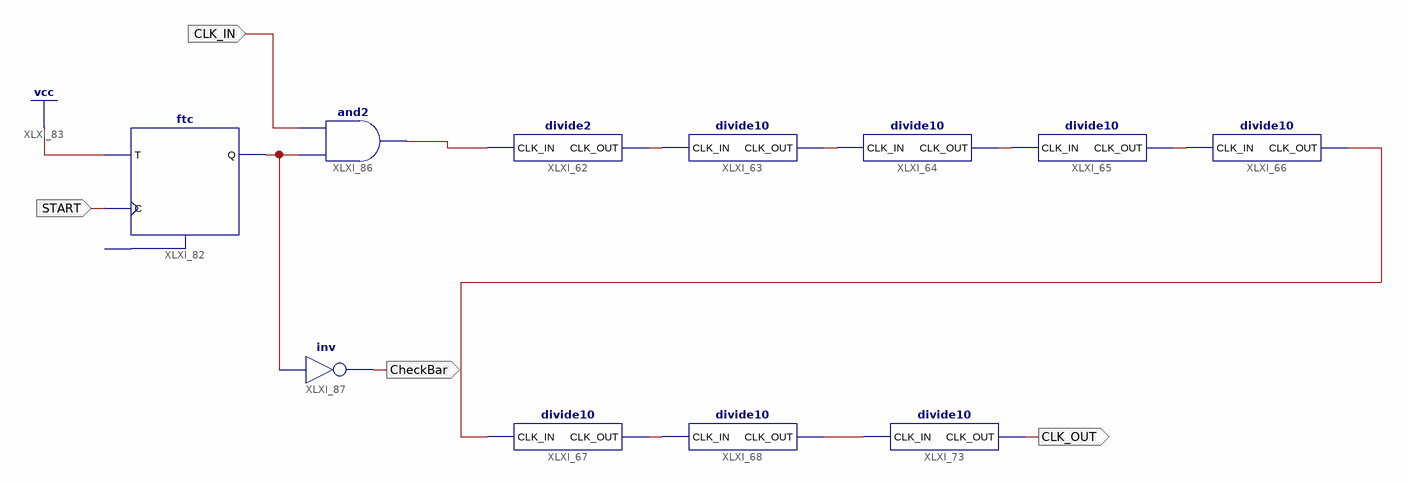
[diagram p0: schematic sheet 1]
// Xilinx ISE schematic Divider2.sch (spartan6) as structural Verilog: 11 symbols, 4 ports
module Divider2 (
  input  START,
  input  CLK_IN,
  output CLK_OUT,
  output CheckBar
);

  wire CLK_10K, XLXN_124, XLXN_125, XLXN_126, XLXN_127, XLXN_128, XLXN_138, XLXN_156, XLXN_157;

  divide2 XLXI_62 (.CLK_IN(XLXN_157), .CLK_OUT(XLXN_124));
  divide10 XLXI_63 (.CLK_IN(XLXN_124), .CLK_OUT(XLXN_125));
  divide10 XLXI_64 (.CLK_IN(XLXN_125), .CLK_OUT(XLXN_126));
  divide10 XLXI_65 (.CLK_IN(XLXN_126), .CLK_OUT(XLXN_127));
  divide10 XLXI_66 (.CLK_IN(XLXN_127), .CLK_OUT(CLK_10K));
  divide10 XLXI_67 (.CLK_IN(CLK_10K), .CLK_OUT(XLXN_128));
  divide10 XLXI_68 (.CLK_IN(XLXN_128), .CLK_OUT(XLXN_138));
  divide10 XLXI_73 (.CLK_IN(XLXN_138), .CLK_OUT(CLK_OUT));
  ftc XLXI_82 (.C(START), .T(1'b1), .Q(XLXN_156));  // open: CLR
  and XLXI_86 (XLXN_157, XLXN_156, CLK_IN);
  not XLXI_87 (CheckBar, XLXN_156);
endmodule
